# EasyEDA schematic avionics_system.json
TITLE: Flight Computer of Model Rocket; REV: 1.0; Date: 2023-10-12; Sheet: 1/1; Drawn By: shakur_siam; Company: AUST Rocketry
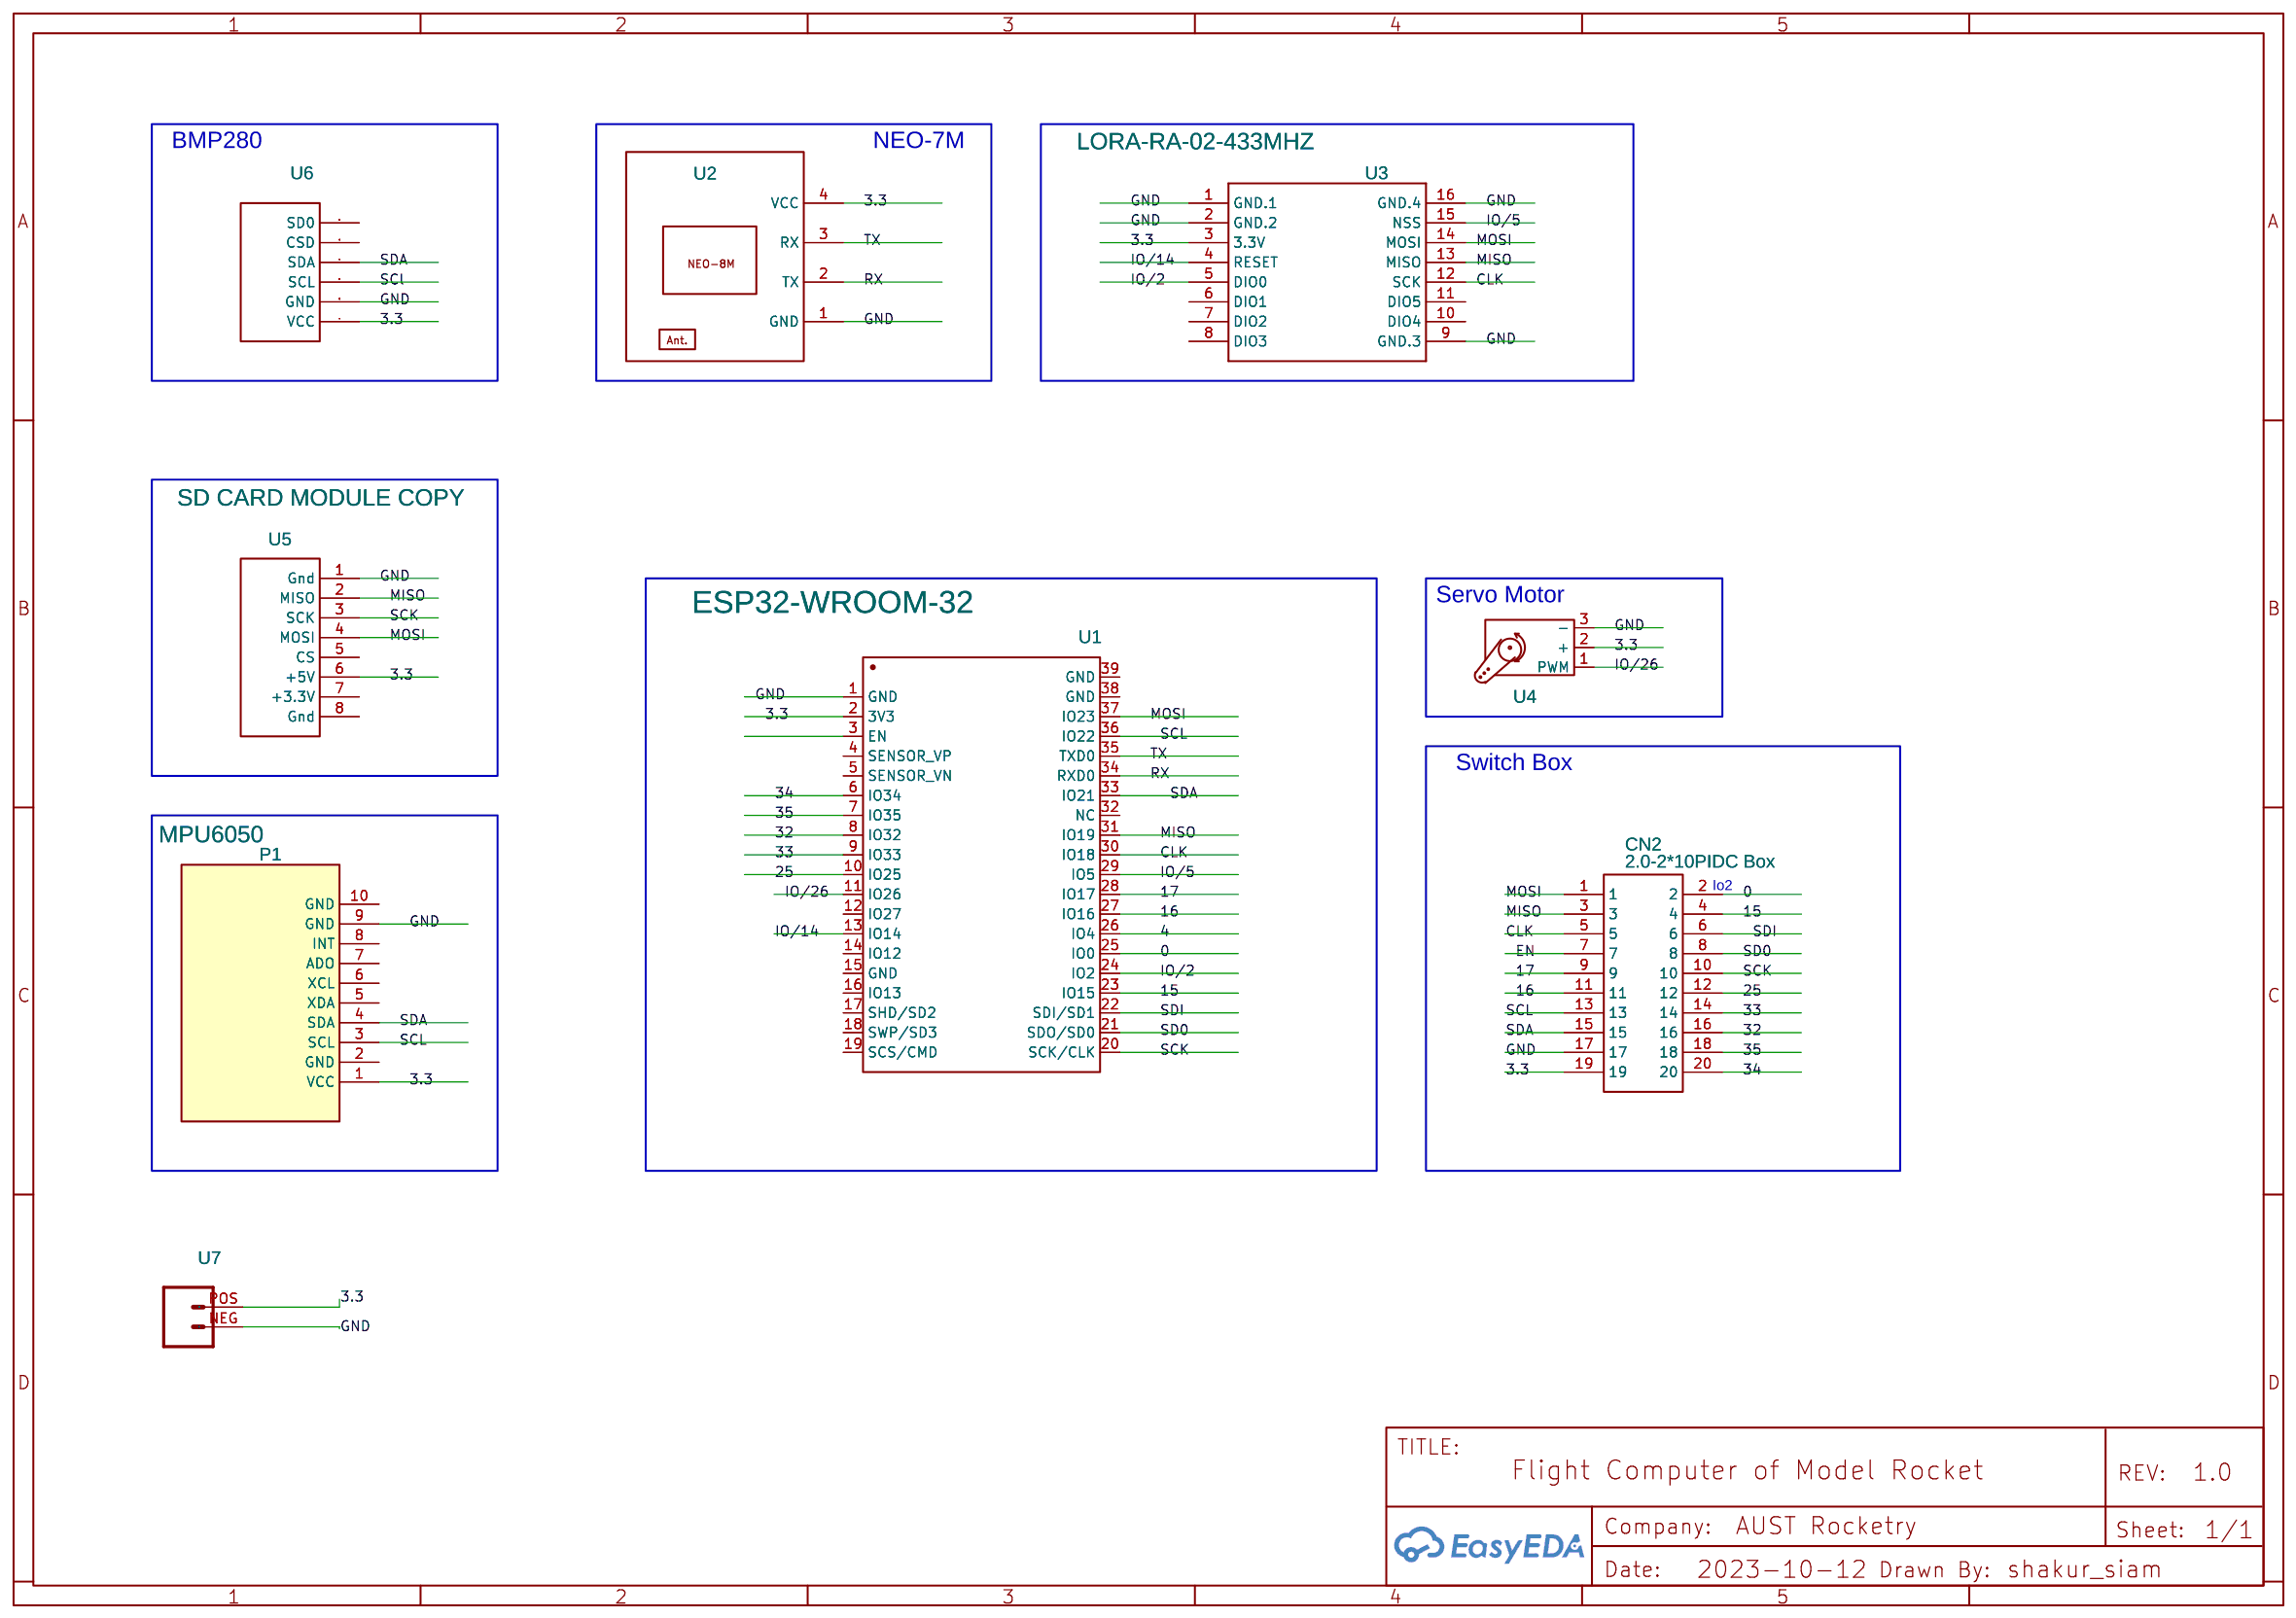
[diagram p0: schematic sheet]

## Parts
CN2  2.0-2*10PIDC Box  [IDC-TH_2.0-2-10PIDCBOX]
P1  MPU6050  [MPU6050]
U1  ESP32-WROOM-32  [WIFIM-SMD_ESP32-WROOM-32-N4]
U2  -  [GY-GPSV3-NEO]
U3  LORA-RA-02-433MHZ  [LORA-RA2-SMD]
U4  -  [KKTL-MOTOR-SERVO-01]
U5  SD CARD MODULE COPY  [SD CARD MODULE W/ SD CARD]
U6  NO  [BMP280YSF BMP280YSF BMP280YSF BMP]
U7  -  [TIMWOO-CONNECTORS_9V_BATTERY_CONNECTOR]

## Library data of the parts
CN2 = 2.0-2*10PIDC Box: Supplier: LCSC; Manufacturer: BOOMELE(博穆精密); Manufacturer Part: 2.0-2*10P简牛; Supplier Part: C55267; JLCPCB Part Class: Extended Part; link: https://lcsc.com/eda_search?q=C55267&%26type=1&ref=editor
P1 = MPU6050: sourceId: 1T5FDZYC8; Contributor: Jerwin John A Flores
U1 = ESP32-WROOM-32: Contributor: LCSC; Supplier: LCSC; Supplier Part: C82899; Manufacturer: ESPRESSIF(乐鑫); Manufacturer Part: ESP32-WROOM-32-N4; JLCPCB Part Class: Extended Part; link: https://lcsc.com/eda_search?q=C82899&%26type=1&ref=editor
U2 = GY-GPSV3-NEO-copy: Contributor: aquin
U3 = LORA-RA-02-433MHZ: 433 MHz Lora Ra-02 Radio Transceiver Module based on SX1276 chip.; Contributor: Pichuntru
U4 = KKTL-Motor-Servo-01: Contributor: kakatuland
U5 = SD CARD MODULE COPY: Manufacturer Part: sd card module; Contributor: Leandro_ribeiro; Supplier: LCSC
U6 = BMP280: Contributor: davidalejo0401
U7 = TIMWOO-CONNECTORS_M02SNAP_CONN: Contributor: moun313131

## Nets
GND: CN2.17 P1.9(GND) U1.1(GND) U2.1(GND) U3.1(GND.1) U3.2(GND.2) U3.9(GND.3) U3.16(GND.4) U4.3(-) U5.1(Gnd) U6.6(GND) U7.NEG(1)
0: CN2.2 U1.25(IO0)
3.3: CN2.19 P1.1(VCC) U1.2(3V3) U2.4(VCC) U3.3(3.3V) U4.2(+) U5.6(+5V) U6.7(VCC) U7.POS(2)
4: U1.26(IO4)
15: CN2.4 U1.23(IO15)
16: CN2.11 U1.27(IO16)
17: CN2.9 U1.28(IO17)
25: CN2.12 U1.10(IO25)
32: CN2.16 U1.8(IO32)
33: CN2.14 U1.9(IO33)
34: CN2.20 U1.6(IO34)
35: CN2.18 U1.7(IO35)
CLK: CN2.5 U1.30(IO18) U3.12(SCK)
EN: CN2.7
IO/2: U1.24(IO2) U3.5(DIO0)
IO/5: U1.29(IO5) U3.15(NSS)
IO/14: U1.13(IO14) U3.4(RESET)
IO/26: U1.11(IO26) U4.1(PWM)
MISO: CN2.3 U1.31(IO19) U3.13(MISO) U5.2(MISO)
MOSI: CN2.1 U1.37(IO23) U3.14(MOSI) U5.4(MOSI)
RX: U1.34(RXD0) U2.2(TX)
SCK: CN2.10 U1.20(SCK/CLK) U5.3(SCK)
SCL: CN2.13 P1.3(SCL) U1.36(IO22)
SCl: U6.5(SCL)
SD0: CN2.8 U1.21(SDO/SD0)
SDA: CN2.15 P1.4(SDA) U1.33(IO21) U6.4(SDA)
SDI: CN2.6 U1.22(SDI/SD1)
TX: U1.35(TXD0) U2.3(RX)

Not connected (* = marked no-connect by the designer): P1 2(GND) 5(XDA) 6(XCL) 7(ADO) 8(INT) 10(GND); U1 3(EN) 4(SENSOR_VP) 5(SENSOR_VN) 12(IO27) 14(IO12) 15(GND) 16(IO13) 17(SHD/SD2) 18(SWP/SD3) 19(SCS/CMD) 32(NC) 38(GND) 39(GND); U3 6(DIO1) 7(DIO2) 8(DIO3) 10(DIO4) 11(DIO5); U5 5(CS) 7(+3.3V) 8(Gnd); U6 2(SD0) 3(CSD)

## Notes on the sheet
- BMP280
- NEO-7M
- Servo Motor
- Switch Box
- Io2
